# EAGLE schematic bbg (EAGLE 6.5.0)
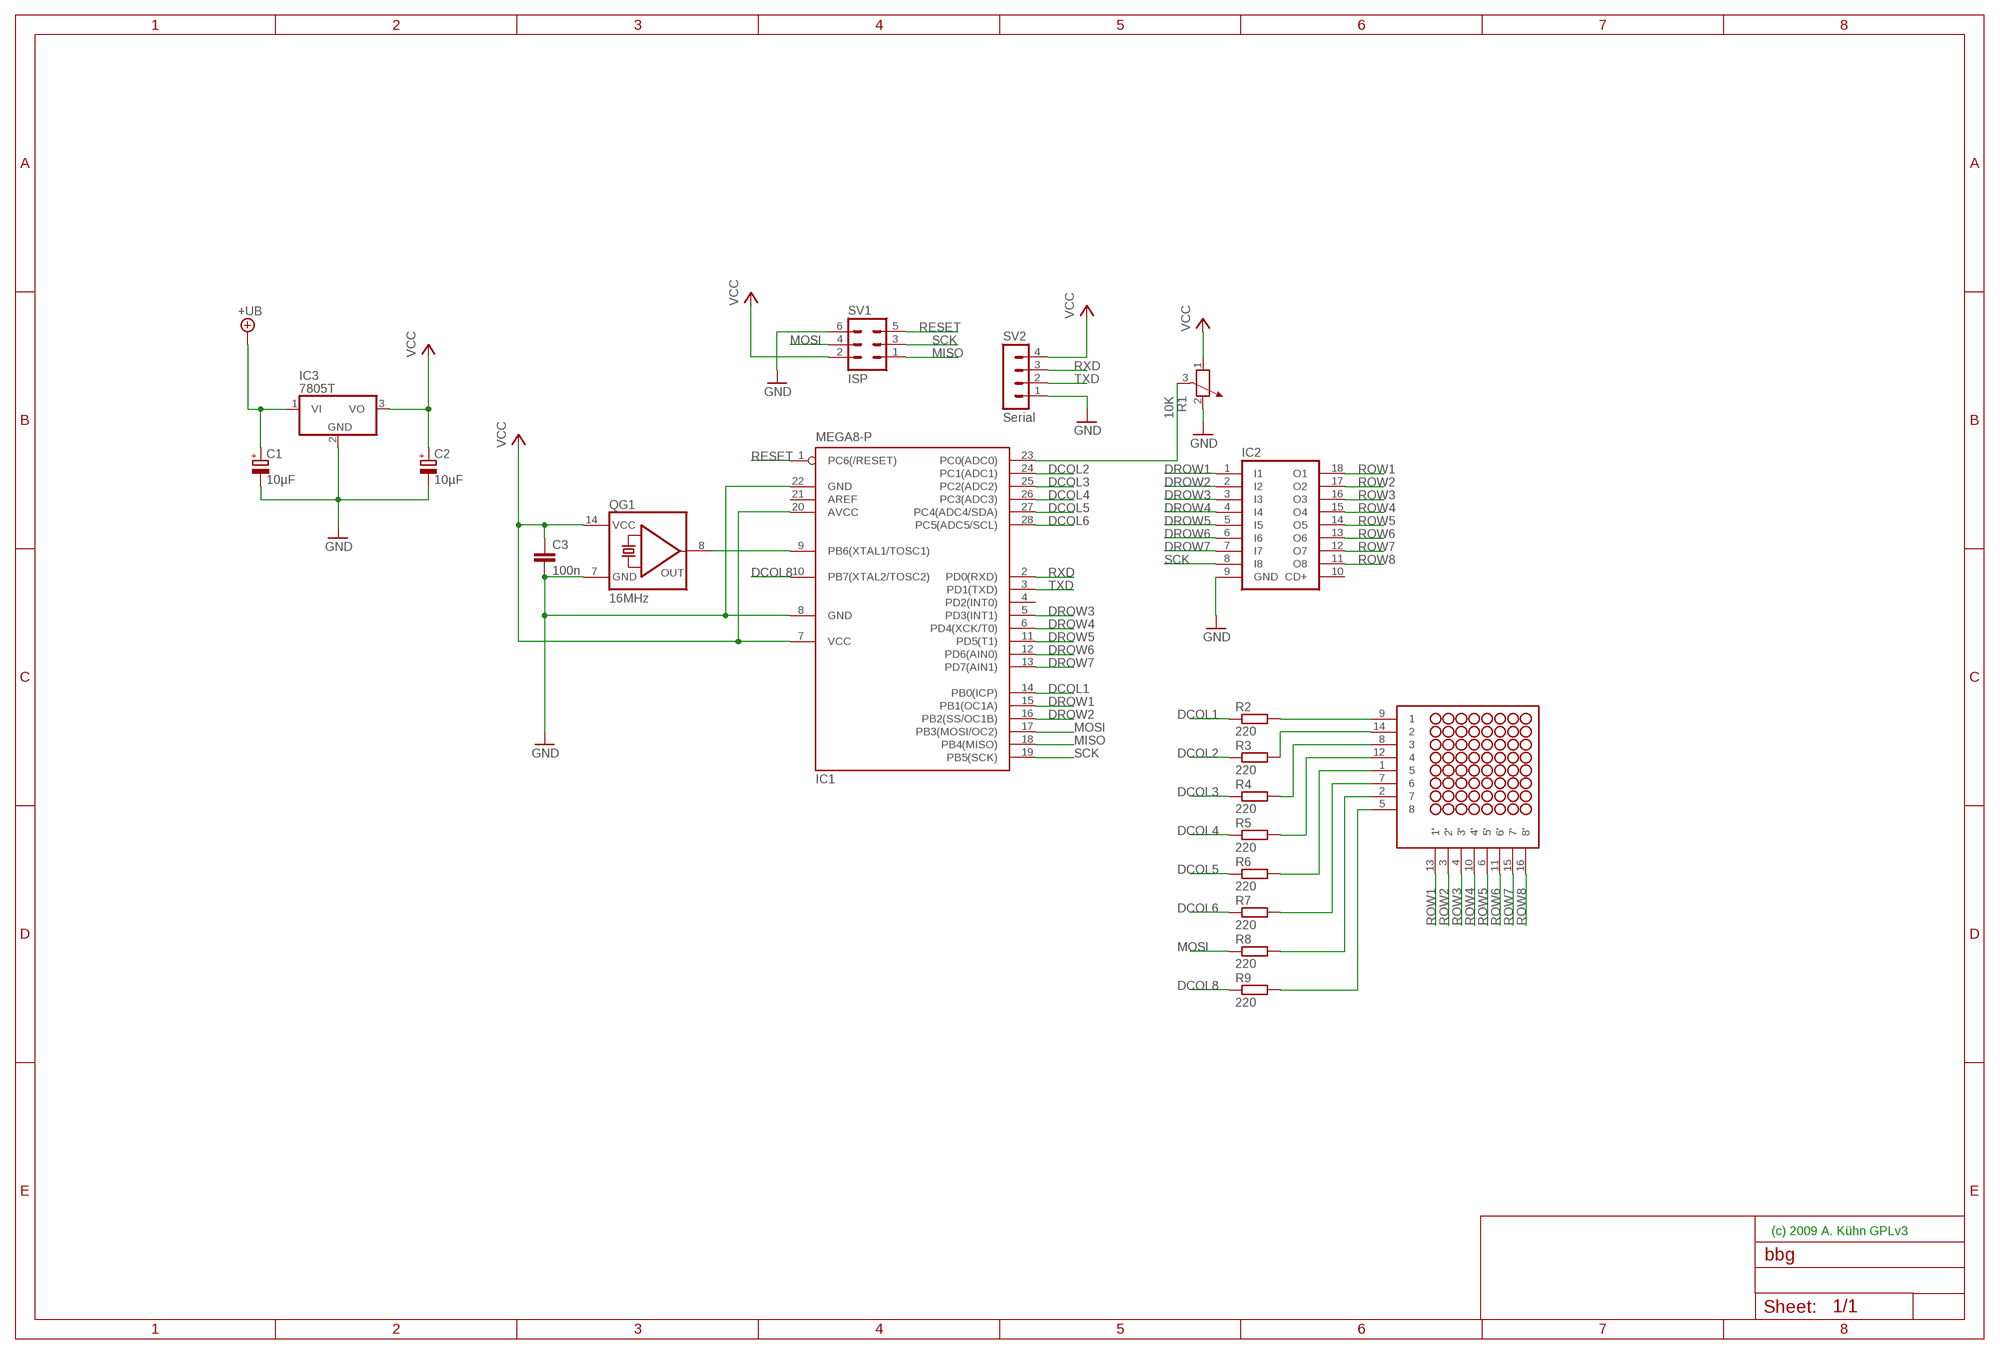
[diagram p0: schematic, sheet 1]

## Parts
C1  10µF  CPOL-EUE10-20  [EB20D]
C2  10µF  CPOL-EUE10-20  [EB20D]
C3  100n  C-EUC0603  [C0603]
IC1  MEGA8-P  [DIL28-3]
IC2  ULN2803A  [DIL18]
IC3  7805T  [TO220H]
QG1  16MHz  QG5860  [DIL14S]
R1  10K  POTENTIOMETER_PT-10  [PT-10]
R2  220  R-EU_0204/2V  [0204V]
R3  220  R-EU_0204/2V  [0204V]
R4  220  R-EU_0204/2V  [0204V]
R5  220  R-EU_0204/2V  [0204V]
R6  220  R-EU_0204/2V  [0204V]
R7  220  R-EU_0204/2V  [0204V]
R8  220  R-EU_0204/2V  [0204V]
R9  220  R-EU_0204/2V  [0204V]
SV1  ISP  MA03-2  [MA03-2]
SV2  Serial  MA04-1  [MA04-1]
U$1  NFM-12881BG-11  [NFM-12881BG-11]

## Nets
+UB: C1.+ IC3.1(VI)
DCOL1: IC1.14(PB0(ICP)) R2.1
DCOL2: IC1.24(PC1(ADC1)) R3.1
DCOL3: IC1.25(PC2(ADC2)) R4.1
DCOL4: IC1.26(PC3(ADC3)) R5.1
DCOL5: IC1.27(PC4(ADC4/SDA)) R6.1
DCOL6: IC1.28(PC5(ADC5/SCL)) R7.1
DCOL8: IC1.10(PB7(XTAL2/TOSC2)) R9.1
DROW1: IC1.15(PB1(OC1A)) IC2.1(I1)
DROW2: IC1.16(PB2(SS/OC1B)) IC2.2(I2)
DROW3: IC1.5(PD3(INT1)) IC2.3(I3)
DROW4: IC1.6(PD4(XCK/T0)) IC2.4(I4)
DROW5: IC1.11(PD5(T1)) IC2.5(I5)
DROW6: IC1.12(PD6(AIN0)) IC2.6(I6)
DROW7: IC1.13(PD7(AIN1)) IC2.7(I7)
GND: C1.- C2.- C3.2 IC1.8(GND) IC1.22(GND) IC2.9(GND) IC3.2(GND) QG1.7(GND) R1.2 SV1.6 SV2.1
MISO: IC1.18(PB4(MISO)) SV1.1
MOSI: IC1.17(PB3(MOSI/OC2)) R8.1 SV1.4
N$1: IC1.9(PB6(XTAL1/TOSC1)) QG1.8(OUT)
N$2: IC1.23(PC0(ADC0)) R1.3
N$3: R2.2 U$1.9
N$4: R4.2 U$1.8
N$5: R3.2 U$1.14
N$6: R5.2 U$1.12
N$7: R6.2 U$1.1
N$8: R7.2 U$1.7
N$9: R8.2 U$1.2
N$10: R9.2 U$1.5
RESET: IC1.1(PC6(/RESET)) SV1.5
ROW1: IC2.18(O1) U$1.13(1')
ROW2: IC2.17(O2) U$1.3(2')
ROW3: IC2.16(O3) U$1.4(3')
ROW4: IC2.15(O4) U$1.10(4')
ROW5: IC2.14(O5) U$1.6(5')
ROW6: IC2.13(O6) U$1.11(6')
ROW7: IC2.12(O7) U$1.15(7')
ROW8: IC2.11(O8) U$1.16(8')
RXD: IC1.2(PD0(RXD)) SV2.3
SCK: IC1.19(PB5(SCK)) IC2.8(I8) SV1.3
TXD: IC1.3(PD1(TXD)) SV2.2
VCC: C2.+ C3.1 IC1.7(VCC) IC1.20(AVCC) IC3.3(VO) QG1.14(VCC) R1.1 SV1.2 SV2.4
Unconnected: IC1.4(PD2(INT0)) IC1.21(AREF) IC2.10(CD+)

## Notes on the sheet
- (c) 2009 A. Kühn GPLv3

## Library data of the parts
C1 C2 = rcl:CPOL-EU: POLARIZED CAPACITOR, European symbol
C3 = rcl:C-EU: CAPACITOR, European symbol
IC1 = atmel:MEGA8-P: MICROCONTROLLER 8 Kbytes FLASH, 1 kbytes SRAM, 512 bytes EEPROM, USART, 4-channel 10 bit ADC, 2-channel 8 bit ADC Pin compatible with Atmega48, ATMega88, ATMega168 Source: avr.lbr; OC_FARNELL: unknown; OC_NEWARK: unknown
IC2 = uln-udn:ULN2803A: DRIVER ARRAY
IC3 = linear:78*: Positive VOLTAGE REGULATOR Source: http://cache.national.com/ds/LM/LM78L05.pdf http://www.fairchildsemi.com/ds/LM/LM7805.pdf
QG1 = crystal:QG5860: CRYSTAL RESONATOR; OC_FARNELL: unknown; OC_NEWARK: unknown
R1 = rcl:POTENTIOMETER_: Potentiometer
R2-R9 = rcl:R-EU_: RESISTOR, European symbol
SV1 = con-lstb:MA03-2: PIN HEADER; OC_FARNELL: unknown; OC_NEWARK: unknown
SV2 = con-lstb:MA04-1: PIN HEADER; OC_FARNELL: unknown; OC_NEWARK: unknown
U$1 = eagle-library-edeca.net-v5:NFM-12881BG-11: Futurlec 8x8 LED Matrix